# EAGLE design rfid_module_v2 (EAGLE 8.0.1)
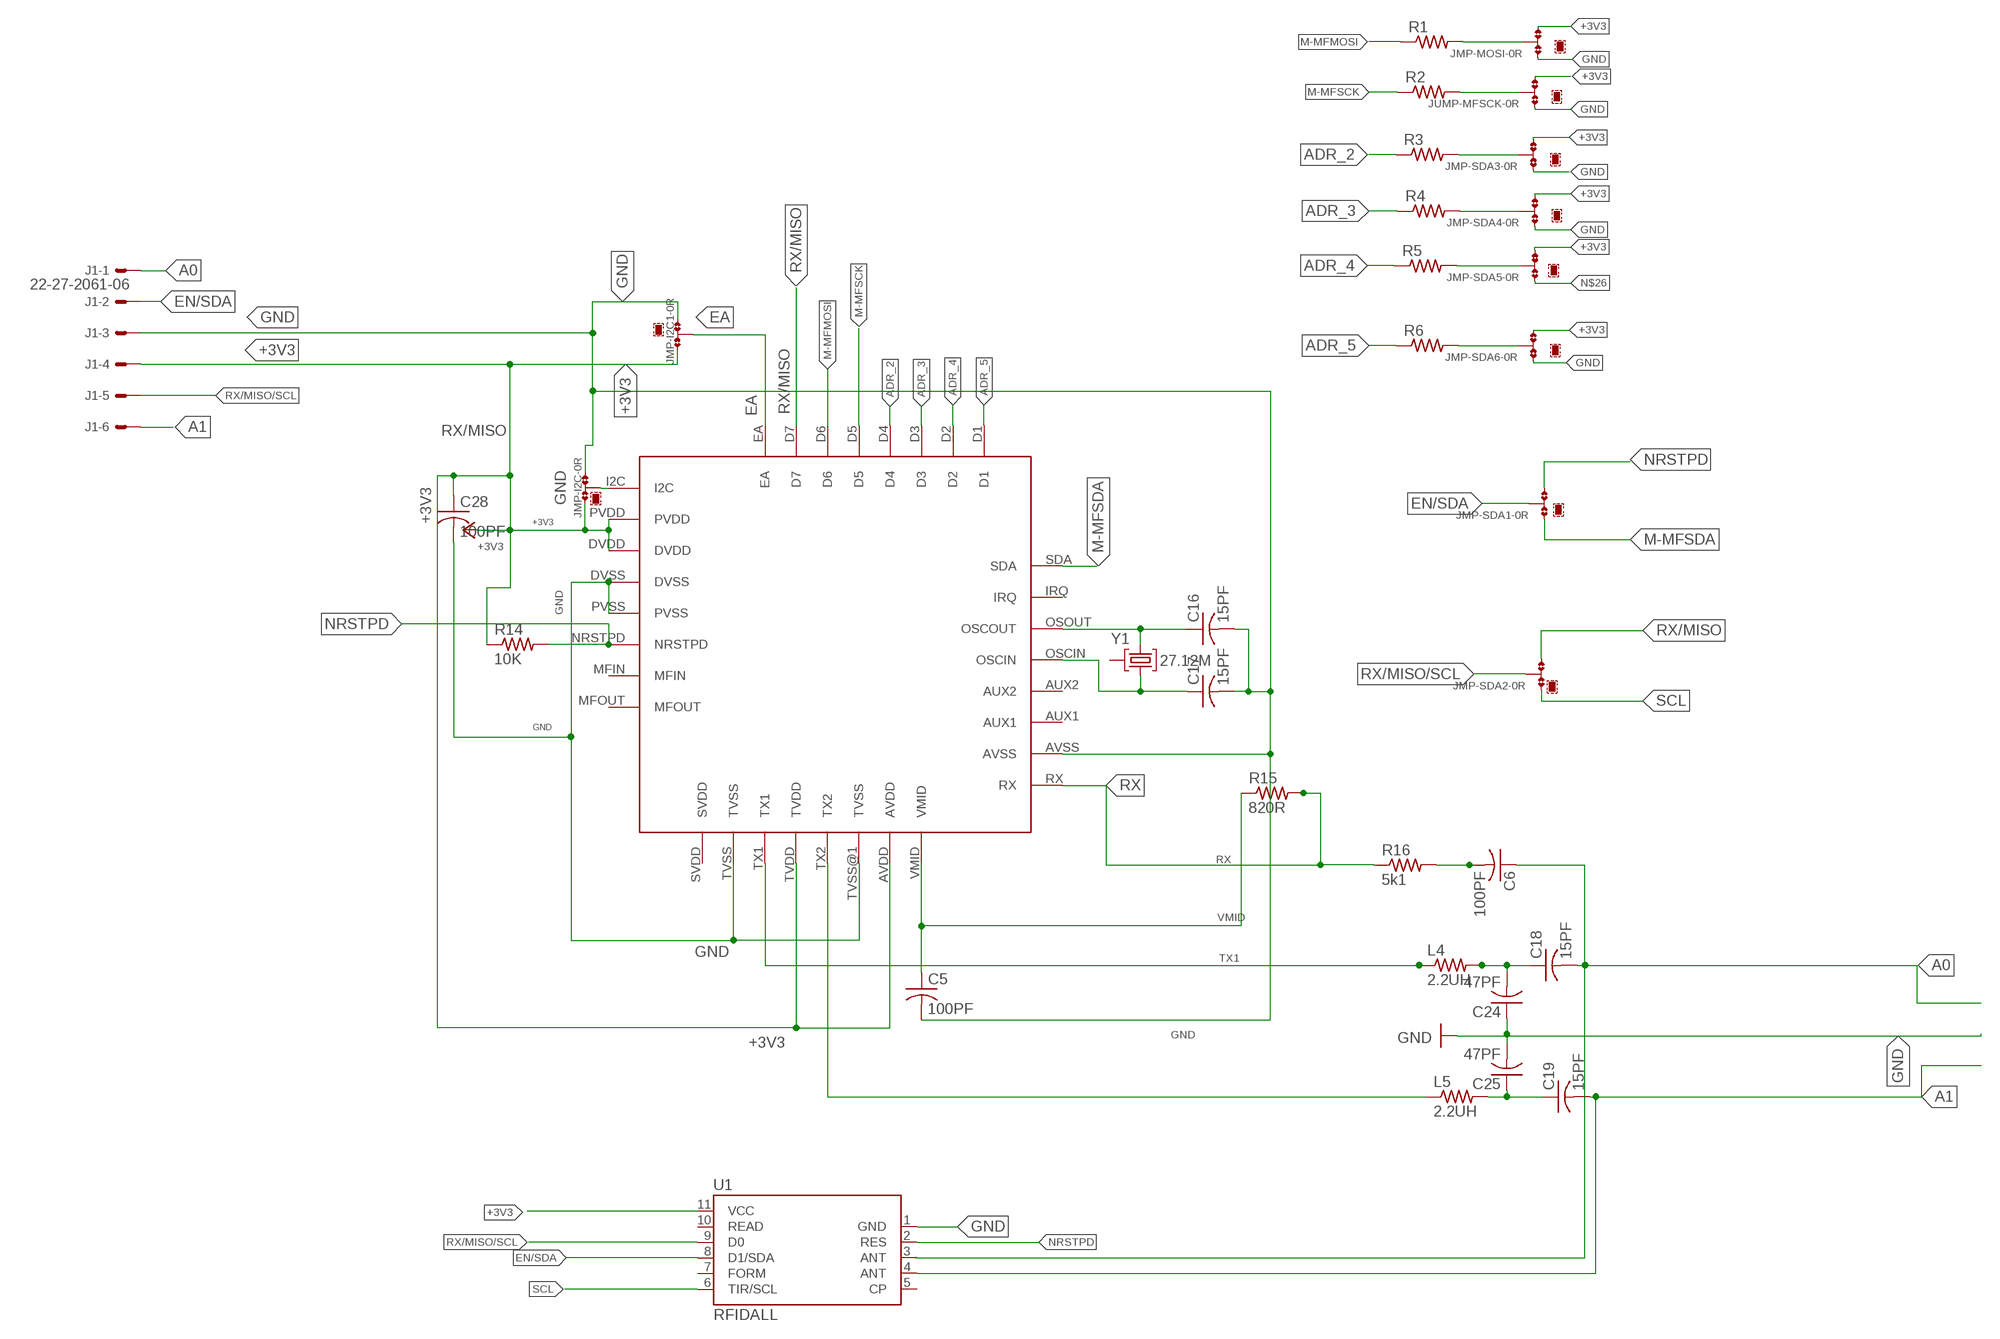
[diagram p0: schematic, sheet 1]

## Parts
C5  100PF  C-USC0402  [C0402]
C6  100PF  C-USC0402  [C0402]
C16  15PF  C-USC0402  [C0402]
C17  15PF  C-USC0402  [C0402]
C18  15PF  C-USC0402  [C0402]
C19  15PF  C-USC0402  [C0402]
C24  47PF  C-USC0402  [C0402]
C25  47PF  C-USC0402  [C0402]
C28  100PF  C-USC0402  [C0402]
J1  22-27-2061-06  [6410-06]
JMP-I2C  0R-JUMPA  [A0R-JMP]
JMP-I2C1  0R-JUMPA  [A0R-JMP]
JMP-MOSI  0R-JUMPA  [A0R-JMP]
JMP-SDA1  0R-JUMPA  [A0R-JMP]
JMP-SDA2  0R-JUMPA  [A0R-JMP]
JMP-SDA3  0R-JUMPA  [A0R-JMP]
JMP-SDA4  0R-JUMPA  [A0R-JMP]
JMP-SDA5  0R-JUMPA  [A0R-JMP]
JMP-SDA6  0R-JUMPA  [A0R-JMP]
JUMP-MFSCK  0R-JUMPA  [A0R-JMP]
L4  2.2UH  R-US_R0402  [R0402]
L5  2.2UH  R-US_R0402  [R0402]
R1  R-US_R0402  [R0402]
R2  R-US_R0402  [R0402]
R3  R-US_R0402  [R0402]
R4  R-US_R0402  [R0402]
R5  R-US_R0402  [R0402]
R6  R-US_R0402  [R0402]
R14  10K  R-US_R0402  [R0402]
R15  820R  R-US_R0402  [R0402]
R16  5k1  R-US_R0402  [R0402]
U1  RFIDALL  [ID_PACKAGE]
U$1  MFRC522  [MFRC522]
Y1  27.12M  CRYSTAL  [RAD3LEAD]

## Nets
+3V3: C28.1 J1.4 JMP-I2C1.3 JMP-I2C.3 JMP-MOSI.3 JMP-SDA3.3 JMP-SDA4.3 JMP-SDA5.3 JMP-SDA6.3 JUMP-MFSCK.3 R14.1 U1.11(VCC) U$1.AVDD U$1.DVDD U$1.PVDD U$1.TVDD ; supply symbol labelled +3.3V
A0: C6.1 C18.2 J1.1
A1: C19.2 J1.6 U1.4(ANT)
ADR_2: R3.1 U$1.D4
ADR_3: R4.1 U$1.D3
ADR_4: R5.1 U$1.D2
ADR_5: R6.1 U$1.D1
EA: JMP-I2C1.2 U$1.EA
EN/SDA: J1.2 JMP-SDA1.2 U1.8(D1/SDA)
GND: C5.2 C16.2 C17.2 C24.1 C25.2 C28.2 J1.3 JMP-I2C1.1 JMP-I2C.1 JMP-MOSI.1 JMP-SDA3.1 JMP-SDA4.1 JMP-SDA6.1 JUMP-MFSCK.1 U1.1(GND) U$1.AVSS U$1.DVSS U$1.PVSS U$1.TVSS U$1.TVSS@1(TVSS)
M-MFMOSI: R1.1 U$1.D6
M-MFSCK: R2.1 U$1.D5
M-MFSDA: JMP-SDA1.1 U$1.SDA
N$1: C16.1 U$1.OSOUT(OSCOUT) Y1.3
N$2: C18.1 C24.2 L4.2
N$3: C17.1 U$1.OSCIN Y1.1
N$4: JMP-MOSI.2 R1.2
N$6: C19.1 C25.1 L5.2
N$7: JMP-I2C.2 U$1.I2C
N$8: L5.1 U$1.TX2
N$9: JUMP-MFSCK.2 R2.2
N$10: C6.2 R16.2
N$11: JMP-SDA3.2 R3.2
N$12: JMP-SDA4.2 R4.2
N$13: JMP-SDA5.2 R5.2
N$14: JMP-SDA6.2 R6.2
N$26: JMP-SDA5.1
NRSTPD: JMP-SDA1.3 R14.2 U1.2(RES) U$1.NRSTPD
RX: R15.2 R16.1 U$1.RX
RX/MISO: JMP-SDA2.3 U$1.D7
RX/MISO/SCL: J1.5 JMP-SDA2.2 U1.9(D0)
SCL: JMP-SDA2.1 U1.6(TIR/SCL)
TX1: L4.1 U$1.TX1
VMID: C5.1 R15.1 U$1.VMID
Unconnected: U1.3(ANT) U1.5(CP) U1.7(FORM) U1.10(READ) U$1.AUX1 U$1.AUX2 U$1.IRQ U$1.MFIN U$1.MFOUT U$1.SVDD Y1.2

## Library data of the parts
C5 C6 C16-C19 C24 C25 C28 = rcl:C-US: CAPACITOR, American symbol
J1 = con-molex:22-?-06: CONNECTOR wire to board 2.54 mm (.1 inch) pitch header; OC_FARNELL: unknown; OC_NEWARK: unknown
JMP-I2C JMP-I2C1 JMP-MOSI JMP-SDA1-JMP-SDA6 JUMP-MFSCK = jump-0r-smd:0R-JUMP: SMD 0R 0805 Jumper
L4 L5 R1-R6 R14-R16 = rcl:R-US_: RESISTOR, American symbol
U1 = ID Innovations:RFID
U$1 = mfrc522:MFRC522
Y1 = RFID Reader Part Library (1):CRYSTAL

## Board
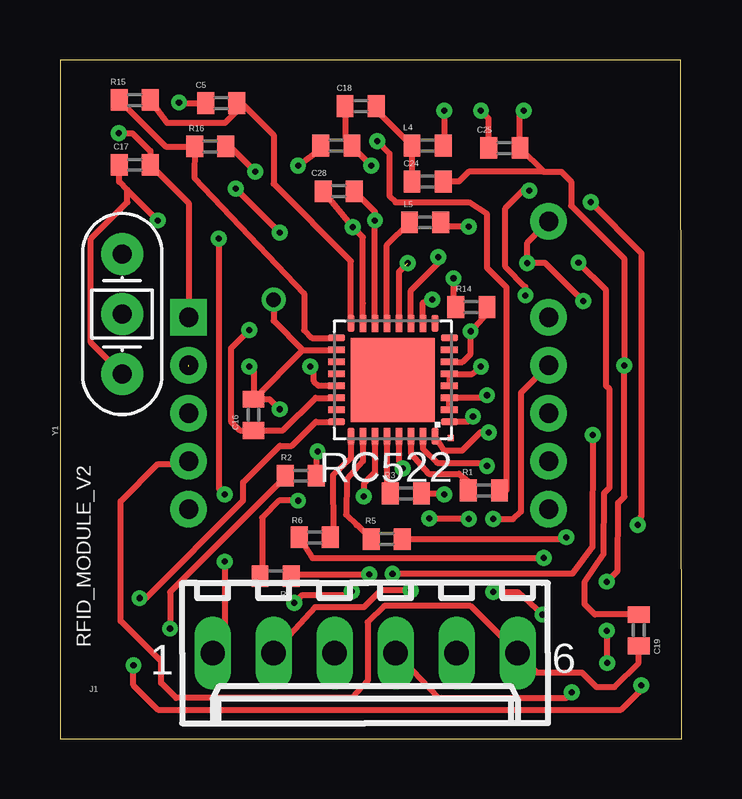
[diagram p1: board, top side]
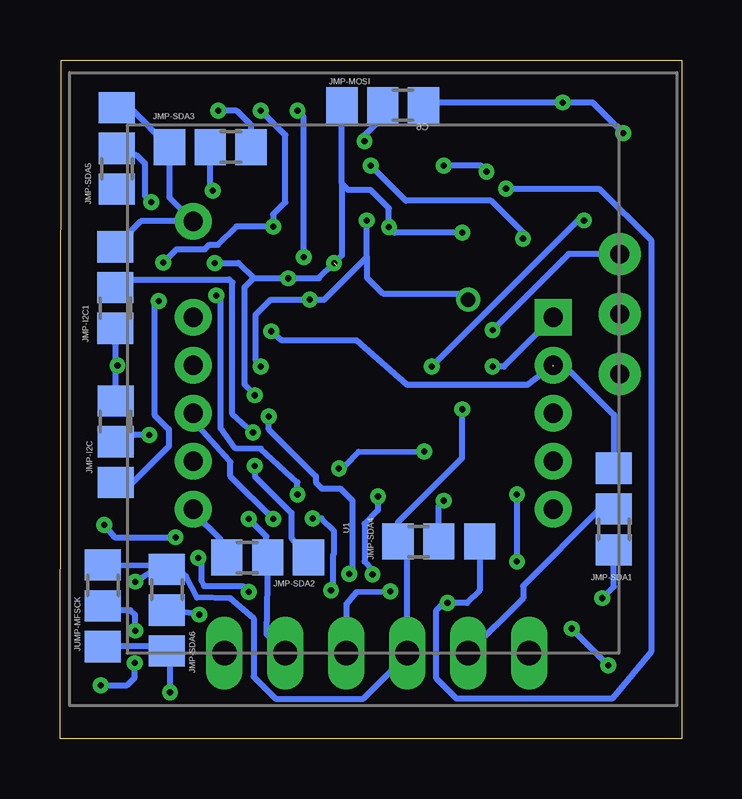
[diagram p2: board, bottom side, seen from below]

Size 25.91 x 28.3 mm. Coordinates in mm from the lower left corner, seen from the top.
Outline: 0.01,0 25.91,0 25.86,28.29 0,28.3 0.01,0
Copper layers (1*16): Top 0.035mm / dielectric 1.5mm / Bottom 0.035mm
Design rules "default *": minimum track width 10mil, minimum drill 10mil, track to track 8mil, track to pad 8mil, pad to pad 8mil, via to via 8mil, smd to smd 8mil, copper to edge 40mil, drill to drill 8mil, minimum pad ring 10mil, minimum via ring 8mil, stop-mask expansion 4mil, vias tented up to drill 0mil, thermal gap 10mil

### Footprints (pad centres in the part's own frame; a part is rotated, then mirrored left to right if it is on the bottom)
C0402 = smd 0.7 x 0.9: 1 -0.65,0; 2 0.65,0
6410-06 = drill 1.016 long: 1 6.35,0; 2 3.81,0; 3 1.27,0; 4 -1.27,0; 5 -3.81,0; 6 -6.35,0
A0R-JMP = smd 1.5 x 1.3: 1 0,1.7; 2 0,0; 3 0,-1.7
R0402 = smd 0.7 x 0.9: 1 -0.65,0; 2 0.65,0
ID_PACKAGE = drill 0.8 pad 1.524 square: 1 3,-7.5 | drill 0.8 pad 1.524: 2 1,-7.5; 3 -1,-7.5; 4 -3,-7.5; 5 -5,-7.5; 6 -5,7.5; 7 -3,7.5; 8 -1,7.5; 9 1,7.5; 10 3,7.5; 11 7,7.5
MFRC522 = smd 0.7 x 0.28: AUX1 2.35,-0.75; AUX2 2.35,-0.25; AVSS 2.35,-1.25; DVDD -2.35,0.75; DVSS -2.35,0.25; I2C -2.35,1.75; IRQ 2.35,1.25; MFIN -2.35,-1.25; MFOUT -2.35,-1.75; NRSTPD -2.35,-0.75; OSCIN 2.35,0.25; OSOUT 2.35,0.75; PVDD -2.35,1.25; PVSS -2.35,-0.25; RX 2.35,-1.75; SDA 2.35,1.75 | smd 0.28 x 0.7: AVDD 1.25,-2.35; D1 1.75,2.35; D2 1.25,2.35; D3 0.75,2.35; D4 0.25,2.35; D5 -0.25,2.35; D6 -0.75,2.35; D7 -1.25,2.35; EA -1.75,2.35; SVDD -1.75,-2.35; TVDD -0.25,-2.35; TVSS -1.25,-2.35; TVSS@1 0.75,-2.35; TX1 -0.75,-2.35; TX2 0.25,-2.35; VMID 1.75,-2.35 | smd 3.5 x 3.5: EXP 0,0 | smd 0.25 x 0.25: M1 -2.415,2.415
RAD3LEAD = drill 0.8 pad 1.75: 1 -2.5,0; 2 0,0; 3 2.5,0

### Placement (x,y rotation side)
C5  6.72,26.5 180 top
C6  11.51,24.73 180 top
C16  8.07,13.5 90 top
C17  3.11,23.93 0 top
C18  12.53,26.37 180 top
C19  24.11,4.53 270 top
C24  15.31,23.23 180 top
C25  18.51,24.63 0 top
C28  11.61,22.83 0 top
J1  12.71,3.57 180 top
JMP-I2C  23.59,12.38 0 bottom
JMP-I2C1  23.61,18.81 180 bottom
JMP-MOSI  12.46,26.42 270 bottom
JMP-SDA1  2.83,9.58 180 bottom
JMP-SDA2  17.26,7.56 90 bottom
JMP-SDA3  19.65,24.67 270 bottom
JMP-SDA4  10.12,8.23 90 bottom
JMP-SDA5  23.54,24.62 180 bottom
JMP-SDA6  21.45,5.36 0 bottom
JUMP-MFSCK  24.12,5.54 0 bottom
L4  15.31,24.73 180 top
L5  15.21,21.53 0 top
R1  17.66,10.35 0 top
R2  10.03,10.97 180 top
R3  14.41,10.23 0 top
R4  8.99,6.78 180 top
R5  13.61,8.33 0 top
R6  10.61,8.4 180 top
R14  17.14,18 0 top
R15  3.11,26.63 180 top
R16  6.26,24.69 0 top
U1  12.86,14.57 90 bottom
U$1  13.87,14.96 180 top
Y1  2.59,17.71 90 top

### Tracks (layer width: path | path; a pad name or v marks a point on that pad's centre or on a via)
+3V3  (via drill 0.25, 0.25 pad 0.25)  (1 unrouted)
  Top 0.254: U$1.TVDD 14.12,19.46 v14.49,19.83 | U$1.PVDD U$1.DVDD 17.68,14.21 v17.79,14.32 | J1.4 15.76,1.7 21.09,1.7 v21.33,1.94 | 12.62,18.14 U$1.AVDD 12.62,20.91 v12.2,21.33 C28.1 | v7.33,22.93 v9.16,21.1 | v9.77,5.66 10.1,5.99 12,5.99 v12.15,6.14 | v21.8,18.25 20.21,19.83 v19.47,19.83 19.47,20.68 U1.11 | v16.4,19.2 16.4,18.09 R14.1
  Bottom 0.254: 14.16,23.13 JMP-MOSI.3 | 14.16,23.13 14.16,20.16 v14.49,19.83 15.13,19.2 v16.4,19.2 17.84,19.2 | J1.4 13.98,5.61 13.55,6.12 v12.15,6.14 | v7.33,22.93 3.44,22.93 1.28,20.8 1.28,3.63 2.91,1.67 9.39,1.67 10.22,2.51 10.22,5.35 9.92,5.66 v9.77,5.66 8.95,5.66 8.42,6.19 JMP-SDA4.3 | 24.16,10.94 JMP-I2C.3 | JMP-SDA5.3 22.99,26.32 JMP-SDA3.3 21.35,22.56 U1.11 22.54,21.57 JMP-I2C1.3 | v9.16,21.1 11.97,21.1 v12.2,21.33 12.2,22.12 12.97,22.88 13.91,22.88 14.16,23.13 | v17.79,14.32 17.79,14.35 18.22,14.78 18.22,18.82 17.84,19.2 | JMP-I2C.3 22.91,10.68 | v21.8,18.25 21.98,18.06 21.98,13.51 21.37,12.9 21.37,12.19 22.88,10.68 JMP-I2C.3 | JUMP-MFSCK.3 21.49,3.84 21.47,3.83 JMP-SDA6.3 21.09,3.3 21.33,3.07 v21.33,1.94 | 17.84,19.2 18.48,19.83 v19.47,19.83
A0  (via drill 0.25)
  Top 0.254: C6.1 12.16,24.7 v12.97,23.9 11.88,24.98 C18.2 | 6.62,3.83 J1.1 6.87,4.08 v6.87,7.39 | v6.62,20.85 6.62,10.43 v6.87,10.18
  Bottom 0.254: v6.62,20.85 6.62,21.1 7.94,22.43 11.5,22.43 v12.97,23.9 | v6.87,10.18 v6.87,7.39
A1
  Top 0.254: C19.2 24.11,3.17 23.1,2.16 22.35,2.16 21.75,2.76 19.88,2.76 J1.6 17.1,5.53 13.5,5.53 12.81,4.87 12.81,2.41 12.18,1.7 4.84,1.7 4.21,2.32 4.21,3.23 2.53,4.91 2.53,9.9 4.08,11.45 5.23,11.45 U1.4
ADR_2
  Top 0.254: 13.98,10.45 R3.1 13.62,10.37 U$1.D4
ADR_3  (via drill 0.25, 0.25 pad 0.25)
  Top 0.254: U$1.D3 13.12,11.1 12.66,10.64 v12.66,10.1 | R4.1 9.71,6.85 v12.89,6.85
  Bottom 0.254: v12.66,10.1 12.66,9.52 13.22,8.96 13.22,7.39 12.89,7.06 v12.89,6.85
ADR_4
  Top 0.254: 12.62,8.67 R5.1 12.38,8.91 12.36,8.91 11.93,9.34 11.95,10.82 12.62,11.56 U$1.D2
ADR_5
  Top 0.254: U$1.D1 12.12,11.7 11.37,10.99 11.39,8.53 R6.1
EA  (via drill 0.25)
  Top 0.254: U$1.EA 16,12.01 16.75,12.01 17.51,12.77 v17.87,12.77
  Bottom 0.254: v17.87,12.77 18.73,13.53 18.73,19.02 18.86,19.15 23.27,19.15 JMP-I2C1.2 23.5,19.2
EN/SDA  (via drill 0.25 pad 0.25)
  Top 0.254: J1.2 10.63,5.48 12.66,5.48 13.37,6.19 v14.62,6.19 | v15.38,9.19 17.01,9.19 v17.03,9.16
  Bottom 0.254: JMP-SDA1.2 3.41,9.58 6.62,6.37 6.62,5.86 J1.2 | U1.8 20.36,13.25 18.83,11.55 18.81,11.53 18.81,10.94 v17.03,9.16 | v14.62,6.19 14.52,6.29 14.52,7.69 14.49,7.72 14.49,8.66 15.02,9.19 v15.38,9.19
GND  (via drill 0.25, 0.25 pad 0.25, 0.6)
  Top 0.254: U1.1 5.36,22.33 C17.2 3.76,24.5 3.02,25.25 v2.44,25.25 | v7.89,15.51 8.07,15.33 C16.2 | 10.12,16.21 C16.2 | 10.12,16.21 U$1.AVSS | v9.16,13.74 8.74,14.15 C16.2 | v22.78,6.55 23.24,7.01 23.25,9.83 23.51,10.09 v23.51,15.56 23.51,19.97 23.53,19.99 21.3,22.22 21.3,23.24 20.89,23.64 20.15,23.64 | 19.35,24.63 C25.2 | v4.96,26.53 4.99,26.5 C5.2 | U$1.DVSS U$1.PVSS 17.19,15.21 v17.54,15.51 | U$1.TVSS@1 v13.12,21.61 13.12,21.97 C28.2 | U$1.TVSS 15.12,18.18 v15.51,18.31 | v8.9,18.31 8.9,17.43 10.12,16.21 | C24.1 16.62,23.23 17.03,23.64 20.15,23.64 | C25.2 20.15,23.64 | C25.2 19.16,26.03 v19.32,26.18
  Bottom 0.254: U1.1 7.42,15.51 v7.89,15.51 | JUMP-MFSCK.1 21.47,7.23 JMP-SDA6.1 | v9.16,13.74 9.16,11.7 11.82,9.04 JMP-SDA4.1 11.44,7.85 J1.3 11.44,3.5 13.27,1.67 16.93,1.67 17.84,2.59 17.84,5.02 18.81,5.86 20.21,5.89 20.66,6.78 21.04,7.13 21.27,7.16 JMP-SDA6.1 | 23.88,14.07 JMP-I2C.1 | 23.87,17.1 JMP-I2C1.1 23.61,14.1 JMP-I2C.1 | 17.95,25.22 JMP-SDA3.1 17.95,25.58 18.55,26.18 v19.32,26.18 | v22.78,6.55 21.83,7.16 JMP-SDA6.1 | 23.63,14.12 JMP-I2C.1 | JMP-I2C.1 23.59,15.57 v23.51,15.56 | 10.23,26.94 JMP-MOSI.1 10.65,26.53 v4.96,26.53 3.72,26.53 v2.44,25.25 | 13.12,20.09 14.9,18.31 v15.51,18.31 17.13,18.31 17.77,17.67 17.77,15.79 v17.54,15.51 | 13.12,20.09 v13.12,21.61 | 13.12,20.09 13.12,19.23 12.46,18.56 9.16,18.56 v8.9,18.31
M-MFMOSI
  Top 0.254: U$1.D6 14.62,11.9 15.35,11.04 16.62,11.04 17.26,10.53 R1.1
M-MFSCK  (via drill 0.25 pad 0.25)
  Top 0.254: U$1.D5 14.12,11.56 v14.29,11.27 | v10.73,11.98 10.68,11.93 R2.1
  Bottom 0.254: v10.73,11.98 13.47,11.96 14.03,11.4 v14.29,11.27
M-MFSDA  (via drill 0.25)
  Top 0.254: U$1.SDA 10.66,13.21 9.66,12.21 9.16,12.21 7.63,10.69 7.63,9.93 3.57,5.86 v3.31,5.86
  Bottom 0.254: v3.31,5.86 2.83,6.35 JMP-SDA1.1
N$1  (via drill 0.25)
  Top 0.254: v7.89,17.04 7.12,16.28 7.12,13.23 7.5,12.85 C16.1 9.29,12.85 10.65,14.21 U$1.OSOUT
  Bottom 0.254: v7.89,17.04 4.97,19.96 4.71,20.21 Y1.3
N$2
  Top 0.254: C24.2 L4.2 13.18,26.21 C18.1
N$3  (via drill 0.25)
  Top 0.254: 2.81,22.88 v4.08,21.61 | 2.81,22.88 2.46,23.22 C17.1 | Y1.1 1.28,16.52 1.28,20.85 2.81,22.37 2.81,22.88 | U$1.OSCIN 10.77,14.71 10.58,14.9 10.58,15.36 v10.43,15.51
  Bottom 0.254: v10.43,15.51 4.33,21.61 v4.08,21.61
N$4  (via drill 0.25)
  Top 0.254: v13.22,24.91 13.73,24.4 13.73,22.63 13.98,22.37 17.03,22.37 17.79,21.86 17.79,19.63 18.61,18.82 18.61,10.37 18.59,10.35 R1.2
  Bottom 0.254: JMP-MOSI.2 12.46,25.92 13.22,25.17 v13.22,24.91
N$6  (via drill 0.25, 0.25 pad 0.25)
  Top 0.254: C19.1 22.29,5.18 21.86,5.61 21.86,6.53 22.65,7.7 22.67,10.24 22.9,10.47 22.9,14.57 22.76,14.72 22.76,18.7 v21.6,19.86 | v17.03,21.36 16.03,21.36 L5.2 | C25.1 17.86,25.86 v17.54,26.18
  Bottom 0.254: v21.6,19.86 21.05,20.41 19.87,20.41 19.69,20.59 19.32,20.59 18.55,21.36 v17.03,21.36 17.03,21.86 16.52,22.37 16.52,25.17 v17.54,26.18
N$7  (via drill 0.25, 0.25 pad 0.25)
  Top 0.254: v22.19,12.66 22.19,8 21.35,6.88 v13.86,6.88 | v17.21,13.43 16.99,13.21 U$1.I2C
  Bottom 0.254: 23.73,12.21 JMP-I2C.2 23.31,12.66 v22.19,12.66 | v17.21,13.43 17.21,12.9 15.25,10.94 15.25,10.69 15,10.43 14.24,10.43 13.73,9.93 13.73,7.01 v13.86,6.88
N$8
  Top 0.254: U$1.TX2 13.62,20.59 L5.1
N$9  (via drill 0.25 pad 0.25)
  Top 0.254: R2.2 9.35,10.89 4.58,6.12 v4.58,4.59 | v3.06,3.07 3.06,2.23 4.08,1.21 23.38,1.21 24.21,2.05 v24.21,2.23 | v22.78,4.51 22.78,3.17 v22.8,3.16
  Bottom 0.254: JUMP-MFSCK.2 24.18,5.35 23.59,5.35 23.58,5.36 22.97,5.36 22.78,5.17 v22.78,4.51 | v4.58,4.59 v3.06,3.07 | v24.21,2.23 23.11,2.23 22.8,2.54 v22.8,3.16
N$10  (via drill 0.25)
  Top 0.254: v9.92,23.9 10.86,24.59 C6.2 | R16.2 6.91,24.87 v8.14,23.64
  Bottom 0.254: v8.14,23.64 8.39,23.9 v9.92,23.9
N$11  (via drill 0.25 pad 0.25)
  Top 0.254: R3.2 15.97,10.23 v16.01,10.18 | v19.55,22.86 19.29,22.86 18.55,22.12 18.55,19.68 19.39,18.84 v19.39,18.49
  Bottom 0.254: v16.01,10.18 16.01,10.69 17.54,12.09 18.61,12.11 19.21,12.95 19.21,18.31 v19.39,18.49 | 19.57,24.6 JMP-SDA3.2 19.65,22.96 v19.55,22.86
N$12  (via drill 0.25 pad 0.25)
  Top 0.254: v9.92,9.93 9.13,9.93 8.42,9.22 8.42,6.87 R4.2
  Bottom 0.254: 9.92,8.43 JMP-SDA4.2 10.12,9.72 v9.92,9.93
N$13  (via drill 0.25)
  Top 0.254: v22.11,22.37 24.22,20.24 24.22,9.32 v24.07,8.91 | R5.2 21.02,8.33 v21.09,8.4
  Bottom 0.254: v22.11,22.37 22.36,22.63 22.36,23.98 22.71,24.33 23.25,24.33 JMP-SDA5.2 23.49,24.66 | v21.09,8.4 23.63,8.4 v24.07,8.91
N$14  (via drill 0.25)
  Top 0.254: v18.05,6.12 19.06,6.12 v20.1,5.18 | R6.2 10.52,7.54 v20.15,7.54
  Bottom 0.254: 21.26,5.61 JMP-SDA6.2 21.29,5.35 v20.1,5.18 | v18.05,6.12 18.3,6.37 19.9,6.37 20.01,6.58 20.01,7.4 v20.15,7.54
NRSTPD  (via drill 0.25 pad 0.25)  (1 unrouted)
  Top 0.254: 16.24,15.69 U$1.NRSTPD 16.77,15.71 17.11,16.05 v17.11,16.99 17.79,17.72 R14.2
  Bottom 0.254: U1.2 6.43,14.75 11.44,14.75 13.55,16.61 16.67,16.61 v17.11,16.99 | 5.36,15.53 4.85,15.53 2.83,13.51 JMP-SDA1.3
RX
  Top 0.254: R15.2 4.4,24.69 R16.1 5.61,24.65 5.6,23.39 10.17,18.56 10.17,17.04 10.5,16.71 U$1.RX
RX/MISO  (via drill 0.25)
  Top 0.254: U$1.D7 15.12,12.09 15.71,11.5 17.67,11.5 v17.79,11.37
  Bottom 0.254: v17.79,11.37 17.79,10.94 16.27,9.42 16.27,8.37 JMP-SDA2.3
RX/MISO/SCL  (via drill 0.25)
  Top 0.254: v18.05,9.16 18.88,9.16 19.21,9.47 19.21,14.43 U1.9
  Bottom 0.254: v18.05,9.16 17.31,8.43 JMP-SDA2.2 17.31,4.36 J1.5
SCL
  Bottom 0.254: JMP-SDA2.1 19.21,7.84 19.21,8.3 20.36,9.44 U1.6
TX1  (via drill 0.25)
  Top 0.254: U$1.TX1 14.62,18.69 15.76,19.83 v15.76,20.09 | v16.01,26.18 16.01,24.78 L4.1
  Bottom 0.254: v15.76,20.09 15.76,25.93 v16.01,26.18
VMID
  Top 0.254: R15.1 4.46,25.67 6.87,25.67 7.37,26.17 C5.1 | 7.37,26.43 C5.1 | C5.1 7.37,26.7 8.9,25.17 8.9,23.13 12.12,19.91 U$1.VMID

### Text on the board
tNames: RFID_MODULE_V2